# EAGLE design Wake-up Light Controller (EAGLE 8.4.1)
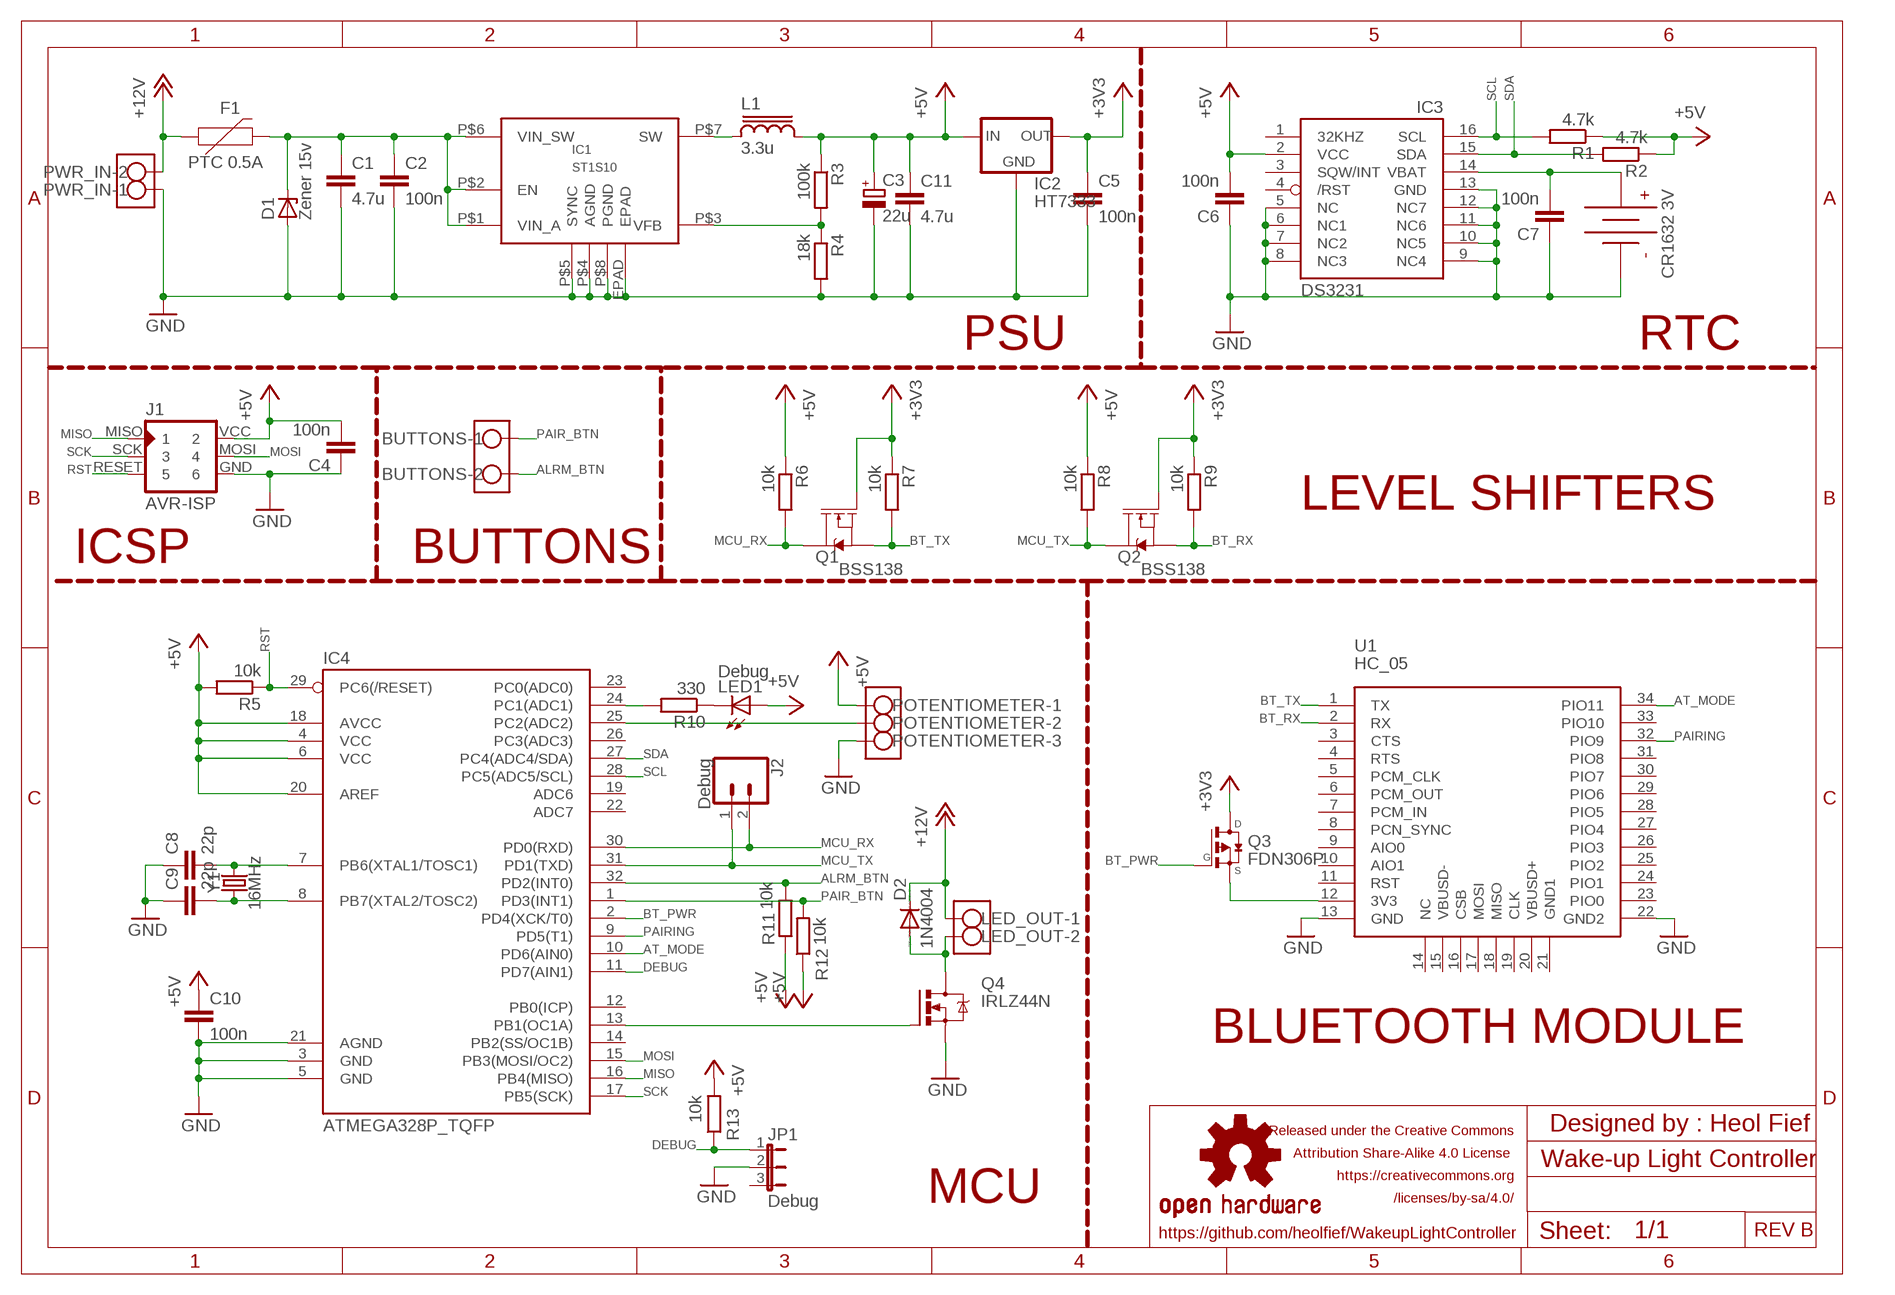
[diagram p0: schematic, sheet 1]

## Parts
BUTTONS  W237-102  [W237-102]
C1  4.7u  C-EUC0805  [C0805]
C2  100n  C-EUC0805  [C0805]
C3  22u  CPOL-EU153CLV-0405  [153CLV-0405]
C4  100n  C-EUC0805  [C0805]
C5  100n  C-EUC0805  [C0805]
C6  100n  C-EUC0805  [C0805]
C7  100n  C-EUC0805  [C0805]
C8  22p  C-EUC0805  [C0805]
C9  22p  C-EUC0805  [C0805]
C10  100n  C-EUC0805  [C0805]
C11  4.7u  C-EUC0805  [C0805]
D1  Zener 15v  ZENER-DIODESOD80C  [SOD80C]
D2  1N4004  DIODE-DO-214AC  [DO-214AC]
F1  PTC 0.5A  PPTC_PTH  [PTH]
IC1  ST1S10  [ST1S10]
IC2  HT7333  [SOT-89]
IC3  DS3231/SO  [SO16W]
IC4  ATMEGA328P_TQFP  [TQFP32-08]
J1  AVR-ISP  AVR-ISP-6PINAVR-ISP-6PIN-SMALL-SILK  [AVR-ISP-6PIN-SMAILL-SILK]
J2  Debug  CONN_021X02_NO_SILK  [1X02_NO_SILK]
J3  CR1632_3V  BATTCON_16MM_PTH  [BATTCON_16MM_PTH]
JP1  Debug  JP2E  [JP2]
L1  3.3u  74437346068  [74437346068]
LED1  Debug  LEDCHIPLED_1206  [CHIPLED_1206]
LED_OUT  W237-102  [W237-102]
LOGO1  OSHW-LOGOM-COPPER  [OSHW-LOGO-M_COPPER]
POTENTIOMETER  W237-103  [W237-103]
PWR_IN  W237-102  [W237-102]
Q1  BSS138  MOSFET-NCH-BSS138  [SOT23-3]
Q2  BSS138  MOSFET-NCH-BSS138  [SOT23-3]
Q3  FDN306P  [SSOT-3]
Q4  IRLZ44N  IRLZ44Z  [TO220BH]
R1  4.7k  RESISTOR_EU  [M0805]
R2  4.7k  R-EU_M0805  [M0805]
R3  100k  R-EU_M0805  [M0805]
R4  18k  R-EU_M0805  [M0805]
R5  10k  R-EU_M0805  [M0805]
R6  10k  RESISTOR_EU  [M0805]
R7  10k  R-EU_M0805  [M0805]
R8  10k  R-EU_M0805  [M0805]
R9  10k  R-EU_M0805  [M0805]
R10  330  R-EU_M0805  [M0805]
R11  10k  R-EU_M0805  [M0805]
R12  10k  R-EU_M0805  [M0805]
R13  10k  R-EU_M0805  [M0805]
U1  HC_05  [BLUETOOTH_SMD]
Y1  16MHz  CRYSTALSMD-3.2X2.5  [CRYSTAL-SMD-3.2X2.5MM]

## Nets
+3V3: C5.1 IC2.1(OUT) Q1.1(G) Q2.1(G) Q3.3(D) R7.1 R9.1
+5V: C3.+ C4.2 C6.2 C10.1 C11.1 IC2.3(IN) IC2.4(IN) IC3.2(VCC) IC4.4(VCC) IC4.6(VCC) IC4.18(AVCC) IC4.20(AREF) J1.VCC L1.2 LED1.A POTENTIOMETER.1 R1.1 R2.1 R3.1 R5.2 R6.1 R8.1 R11.1 R12.1 R13.2
+12V: D2.C F1.P$1 LED_OUT.1 PWR_IN.2
ALRM_BTN: BUTTONS.2 IC4.32(PD2(INT0)) R11.2
AT_MODE: IC4.10(PD6(AIN0)) U1.34(PIO11)
BT_PWR: IC4.2(PD4(XCK/T0)) Q3.1(G)
BT_RX: Q2.2(S) R9.2 U1.2(RX)
BT_TX: Q1.2(S) R7.2 U1.1(TX)
DEBUG: IC4.11(PD7(AIN1)) JP1.1 R13.1
GND: C1.2 C2.2 C3.- C4.1 C5.2 C6.1 C7.1 C8.1 C9.1 C10.2 C11.2 D1.A IC1.EPAD IC1.P$4(AGND) IC1.P$5(SYNC) IC1.P$8(PGND) IC2.2(GND) IC3.5(NC) IC3.6(NC1) IC3.7(NC2) IC3.8(NC3) IC3.9(NC4) IC3.10(NC5) IC3.11(NC6) IC3.12(NC7) IC3.13(GND) IC4.3(GND) IC4.5(GND) IC4.21(AGND) J1.GND J3.GND JP1.2 POTENTIOMETER.3 PWR_IN.1 Q4.S R4.2 U1.13(GND) U1.22(GND2)
MCU_RX: IC4.30(PD0(RXD)) J2.2 Q1.3(D) R6.2
MCU_TX: IC4.31(PD1(TXD)) J2.1 Q2.3(D) R8.2
MISO: IC4.16(PB4(MISO)) J1.MISO
MOSI: IC4.15(PB3(MOSI/OC2)) J1.MOSI
N$1: D2.A LED_OUT.2 Q4.D
N$2: C8.2 IC4.7(PB6(XTAL1/TOSC1)) Y1.3
N$3: IC4.24(PC1(ADC1)) R10.2
N$4: C9.2 IC4.8(PB7(XTAL2/TOSC2)) Y1.1
N$5: Q3.2(S) U1.12(3V3)
N$6: IC1.P$7(SW) L1.1
N$7: IC1.P$3(VFB) R3.2 R4.1
N$8: LED1.C R10.1
N$9: C1.1 C2.1 D1.C F1.P$2 IC1.P$1(VIN_A) IC1.P$2(EN) IC1.P$6(VIN_SW)
N$10: IC4.13(PB1(OC1A)) Q4.G
N$11: IC4.25(PC2(ADC2)) POTENTIOMETER.2
PAIR_BTN: BUTTONS.1 IC4.1(PD3(INT1)) R12.2
PAIRING: IC4.9(PD5(T1)) U1.32(PIO9)
RST: IC4.29(PC6(/RESET)) J1.RESET R5.1
SCK: IC4.17(PB5(SCK)) J1.SCK
SCL: IC3.16(SCL) IC4.28(PC5(ADC5/SCL)) R1.2
SDA: IC3.15(SDA) IC4.27(PC4(ADC4/SDA)) R2.2
VBAT: C7.2 IC3.14(VBAT) J3.VCC@1(VCC) J3.VCC@2(VCC)
Unconnected: IC3.1(32KHZ) IC3.3(SQW/INT) IC3.4(/RST) IC4.12(PB0(ICP)) IC4.14(PB2(SS/OC1B)) IC4.19(ADC6) IC4.22(ADC7) IC4.23(PC0(ADC0)) IC4.26(PC3(ADC3)) JP1.3 U1.3(CTS) U1.4(RTS) U1.5(PCM_CLK) U1.6(PCM_OUT) U1.7(PCM_IN) U1.8(PCN_SYNC) U1.9(AIO0) U1.10(AIO1) U1.11(RST) U1.14(NC) U1.15(VBUSD-) U1.16(CSB) U1.17(MOSI) U1.18(MISO) U1.19(CLK) U1.20(VBUSD+) U1.21(GND1) U1.23(PIO0) U1.24(PIO1) U1.25(PIO2) U1.26(PIO3) U1.27(PIO4) U1.28(PIO5) U1.29(PIO6) U1.30(PIO7) U1.31(PIO8) U1.33(PIO10)

## Notes on the sheet
- CR1632 3V
- PSU | RTC
- LEVEL SHIFTERS
- ICSP | BUTTONS
- BLUETOOTH MODULE
- Designed by : | Heol Fief
- MCU
- Released under the Creative Commons
  Attribution Share-Alike 4.0 License 
  https://creativecommons.org
  /licenses/by-sa/4.0/
- https://github.com/heolfief/WakeupLightController | REV B

## Library data of the parts
BUTTONS LED_OUT PWR_IN = con-wago-500:W237-102: WAGO SCREW CLAMP; MPN: 237-102; OC_FARNELL: unknown; OC_NEWARK: 70K9898
C1 C2 C4-C11 = rcl:C-EU: CAPACITOR, European symbol
C3 = rcl:CPOL-EU: POLARIZED CAPACITOR, European symbol
D1 = diode:ZENER-DIODE: Z-Diode
D2 = diode:DIODE-: DIODE
F1 = SparkFun-Fuses:PPTC: Resettable Fuse PPTC Resettable Fuse. Really a sort of resistor with a polymeric positive temperature coefficient whose resistance increases dramatically with an increase in temperature. When heated by the power passing through the resistance rises causing the current to be limited, protecting the circuit. This is achieved by the transition of the polymer from a crystalline to an amorphous state where the conductive carbon separates breaking the conductive pathways found in the cool crystalline structure. When a PPTC cools back down it resumes conducting letting the circuit turn back on. SparkFun Products: SparkFun RedBoard - Programmed with Arduino <https://www.sparkfun.com/products/12757> Pro Micro - 5V/16MHz <https://www.sparkfun.com/products/12640> Arduino Pro 328 - 5V/16MHz <https://www.sparkfun.com/products/10915> MP3 Trigger <https://www.sparkfun.com/products/13720>; PROD_ID: RES-08490; VALUE: 72V/0.25A
IC1 = BaseApp:ST1S10: Digikey No :- __497-6904-1-ND__
IC2 = holtek2:HT73*
IC3 = adafruit:DS3231
IC4 = SparkFun-IC-Microcontroller:ATMEGA328P_TQFP: Popular 328P in QFP Storefront component: ATmega328 - TQFP <https://www.sparkfun.com/products/13448> (COM-13448) Datasheet <http://www.sparkfun.com/datasheets/Components/SMD/ATMega328.pdf> SparkFun Products SparkFun RedBoard - Programmed with Arduino <https://www.sparkfun.com/products/12757> (DEV-12757) Arduino Pro Mini 328 - 5V/16MHz <https://www.sparkfun.com/products/11113> (DEV-11113) Arduino Pro Mini 328 - 3.3V/8MHz <https://www.sparkfun.com/products/11114> (DEV-11114) SparkFun OpenLog <https://www.sparkfun.com/products/13712> (DEV-13712) SparkFun MicroView - OLED Arduino Module <https://www.sparkfun.com/products/12923> (DEV-12923) SparkFun Digital Sandbox <https://www.sparkfun.com/products/12651> (DEV-12651) SparkFun PicoBoard <https://www.sparkfun.com/products/11888> (WIG-11888) Arduino Fio <https://www.sparkfun.com/products/10116> (DEV-10116) LilyPad Arduino 328 Main Board <https://www.sparkfun.com/products/13342> (DEV-13342) SparkFun RedStick <https://www.sparkfun.com/products/13741> (DEV-13741) LilyPad MP3 <https://www.sparkfun.com/products/11013> (DEV-11013) LilyPad Arduino SimpleSnap <https://www.sparkfun.com/products/10941> (DEV-10941) SparkFun Stepoko <https://www.sparkfun.com/products/13899> (ROB-13899) SparkFun Geiger Counter <https://www.sparkfun.com/products/11345> (SEN-11345) SparkFun EL Sequencer <https://www.sparkfun.com/products/12781> (COM-12781) Arduino Pro 328 - 5V/16MHz <https://www.sparkfun.com/products/10915> (DEV-10915) CryptoCape <https://www.sparkfun.com/products/12773> (DEV-12773) SparkFun IR Thermometer Evaluation Board - MLX90614 <https://www.sparkfun.com/products/10740> (SEN-10740) SparkFun RedBot Mainboard <https://www.sparkfun.com/products/12097> (ROB-12097) Arduino Pro 328 - 3.3V/8MHz <https://www.sparkfun.com/products/10914> (DEV-10914) SparkFun Block for Intel® Edison - Arduino <https://www.sparkfun.com/products/13036> (DEV-13036) SparkFun Simon Says - Surface Mount Soldering Kit <https://www.sparkfun.com/products/10935> (KIT-10935) SparkFun 7-Segment Serial Display - Red <https://www.sparkfun.com/products/11441> (COM-11441) SparkFun 7-Segment Serial Display - White <https://www.sparkfun.com/products/11629> (COM-11629) SparkFun 7-Segment Serial Display - Yellow <https://www.sparkfun.com/products/11443> (COM-11443) SparkFun 7-Segment Serial Display - Kelly Green <https://www.sparkfun.com/products/11440> (COM-11440) SparkFun 7-Segment Serial Display - Blue <https://www.sparkfun.com/products/11442> (COM-11442) SparkFun OpenSegment Serial Display - 20mm (Blue) <https://www.sparkfun.com/products/11647> (COM-11647) SparkFun OpenSegment Serial Display - 20mm (Green) <https://www.sparkfun.com/products/11646> (COM-11646) SparkFun OpenSegment Serial Display - 20mm (White) <https://www.sparkfun.com/products/11648> (COM-11648) SparkFun OpenSegment Serial Display - 20mm (Red) <https://www.sparkfun.com/products/11644> (COM-11644) SparkFun OpenSegment Serial Display - 20mm (Yellow) <https://www.sparkfun.com/products/11645> (COM-11645) SparkFun OpenSegment Shield <https://www.sparkfun.com/products/13190> (DEV-13190); PROD_ID: IC-09069
J1 = avr-isp:AVR-ISP-6PIN: AVR ISP 6pin 3x2 pin header
J2 = SparkFun-Connectors:CONN_02: Multi connection point. Often used as Generic Header-pin footprint for 0.1 inch spaced/style header connections On any of the 0.1 inch spaced packages, you can populate with these: Break Away Headers - Straight <https://www.sparkfun.com/products/116> (PRT-00116) Break Away Male Headers - Right Angle <https://www.sparkfun.com/products/553> (PRT-00553) Female Headers <https://www.sparkfun.com/products/115> (PRT-00115) Break Away Headers - Machine Pin <https://www.sparkfun.com/products/117> (PRT-00117) Break Away Female Headers - Swiss Machine Pin <https://www.sparkfun.com/products/743> (PRT-00743) For SCREWTERMINALS and SPRING TERMINALS visit here: Screw Terimnals on SparkFun.com <https://www.sparkfun.com/search/results?term=Screw+Terminals> (5mm/3.5mm/2.54mm spacing) This device is also useful as a general connection point to wire up your design to another part of your project. Our various solder wires solder well into these plated through hole pads. Hook-Up Wire - Assortment (Stranded, 22 AWG) <https://www.sparkfun.com/products/11375> (PRT-11375) Hook-Up Wire - Assortment (Solid Core, 22 AWG) <https://www.sparkfun.com/products/11367> (PRT-11367) View the entire wire category on our website here <https://www.sparkfun.com/categories/141> Special notes: Molex polarized connector foot print use with: PRT-08233 with associated crimp pins and housings. 2.54_SCREWTERM for use with PRT-10571. 3.5mm Screw Terminal footprints for PRT-08084 5mm Screw Terminal footprints for use with PRT-08432
J3 = heol:BATTCON_16MM_PTH
JP1 = jumper:JP2E: JUMPER
L1 = inductor-wurth:74437346068: POWER INDUCTOR
LED1 = led:LED: LED OSRAM: - CHIPLED LG R971, LG N971, LY N971, LG Q971, LY Q971, LO R971, LY R971 LH N974, LH R974 LS Q976, LO Q976, LY Q976 LO Q996 - Hyper CHIPLED LW Q18S LB Q993, LB Q99A, LB R99A - SideLED LS A670, LO A670, LY A670, LG A670, LP A670 LB A673, LV A673, LT A673, LW A673 LH A674 LY A675 LS A676, LA A676, LO A676, LY A676, LW A676 LS A679, LY A679, LG A679 - Hyper Micro SIDELED® LS Y876, LA Y876, LO Y876, LY Y876 LT Y87S - SmartLED LW L88C, LW L88S LB L89C, LB L89S, LG L890 LS L89K, LO L89K, LY L89K LS L896, LA L896, LO L896, LY L896 - TOPLED LS T670, LO T670, LY T670, LG T670, LP T670 LSG T670, LSP T670, LSY T670, LOP T670, LYG T670 LG T671, LOG T671, LSG T671 LB T673, LV T673, LT T673, LW T673 LH T674 LS T676, LA T676, LO T676, LY T676, LB T676, LH T676, LSB T676, LW T676 LB T67C, LV T67C, LT T67C, LS T67K, LO T67K, LY T67K, LW E67C LS E67B, LA E67B, LO E67B, LY E67B, LB E67C, LV E67C, LT E67C LW T67C LS T679, LY T679, LG T679 LS T770, LO T770, LY T770, LG T770, LP T770 LB T773, LV T773, LT T773, LW T773 LH T774 LS E675, LA E675, LY E675, LS T675 LS T776, LA T776, LO T776, LY T776, LB T776 LHGB T686 LT T68C, LB T68C - Hyper Mini TOPLED® LB M676 - Mini TOPLED Santana® LG M470 LS M47K, LO M47K, LY M47K Source: http://www.osram.convergy.de LUXEON: - LUMILED® LXK2-PW12-R00, LXK2-PW12-S00, LXK2-PW14-U00, LXK2-PW14-V00 LXK2-PM12-R00, LXK2-PM12-S00, LXK2-PM14-U00 LXK2-PE12-Q00, LXK2-PE12-R00, LXK2-PE12-S00, LXK2-PE14-T00, LXK2-PE14-U00 LXK2-PB12-K00, LXK2-PB12-L00, LXK2-PB12-M00, LXK2-PB14-N00, LXK2-PB14-P00, LXK2-PB14-Q00 LXK2-PR12-L00, LXK2-PR12-M00, LXK2-PR14-Q00, LXK2-PR14-R00 LXK2-PD12-Q00, LXK2-PD12-R00, LXK2-PD12-S00 LXK2-PH12-R00, LXK2-PH12-S00 LXK2-PL12-P00, LXK2-PL12-Q00, LXK2-PL12-R00 Source: www.luxeon.com KINGBRIGHT: KA-3528ASYC Source: www.kingbright.com
LOGO1 = SparkFun-Aesthetics:OSHW-LOGO: Open-Source Hardware (OSHW) Logo This logo indicates the piece of hardware it is found on incorporates a OSHW license and/or adheres to the definition of open source hardware found here: http://freedomdefined.org/OSHW
POTENTIOMETER = con-wago-500:W237-103: WAGO SCREW CLAMP; MPN: 237-103; OC_FARNELL: unknown; OC_NEWARK: 18M7116
Q1 Q2 = SparkFun-DiscreteSemi:MOSFET-NCH: N-channel MOSFETs Voltage controlled devices that allow control of high current outputs. SparkFun Products: SparkFun OpenScale <https://www.sparkfun.com/products/13261> SparkFun Digital Sandbox <https://www.sparkfun.com/products/12651> SparkFun Monster Moto Shield <https://www.sparkfun.com/products/10182> SparkFun MOSFET Power Controller <https://www.sparkfun.com/products/11214>; PROD_ID: TRANS-00830; VALUE: 220mA/50V/3.5Ω
Q3 = transistor-fet:FDN306P: P-Channel MOSFET 1.8V Specified PowerTrench
Q4 = transistor-power:IRLZ44Z: N-Channel HEXFET® Power MOSFET Logic Level AUTOMOTIVE MOSFET Source: http://www.irf.com/product-info/datasheets/data/irlz44zpbf.pdf
R1 R6 = heol:RESISTOR_EU
R2-R5 R7-R13 = resistor:R-EU_: RESISTOR, European symbol
U1 = SerialPortBluetooth:HC_05
Y1 = SparkFun-Clocks:CRYSTAL: Crystals (Generic) These are passive quartz crystals, which can be used as a clock source for a microcontroller. Crystal's are two-terminal devices. They require external "load" capacitors to generate an oscillating signal.

## Board
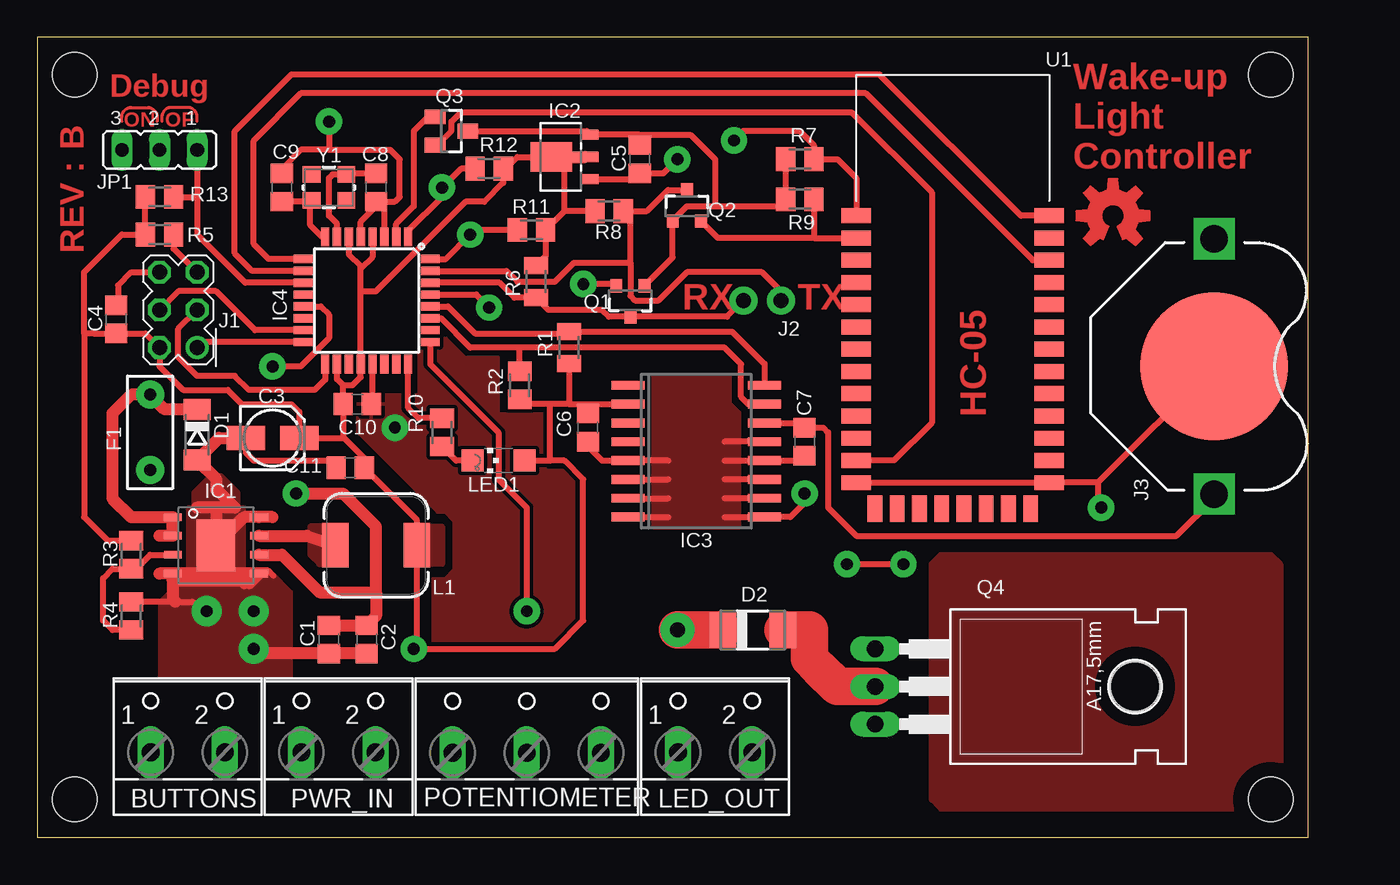
[diagram p1: board, top side]
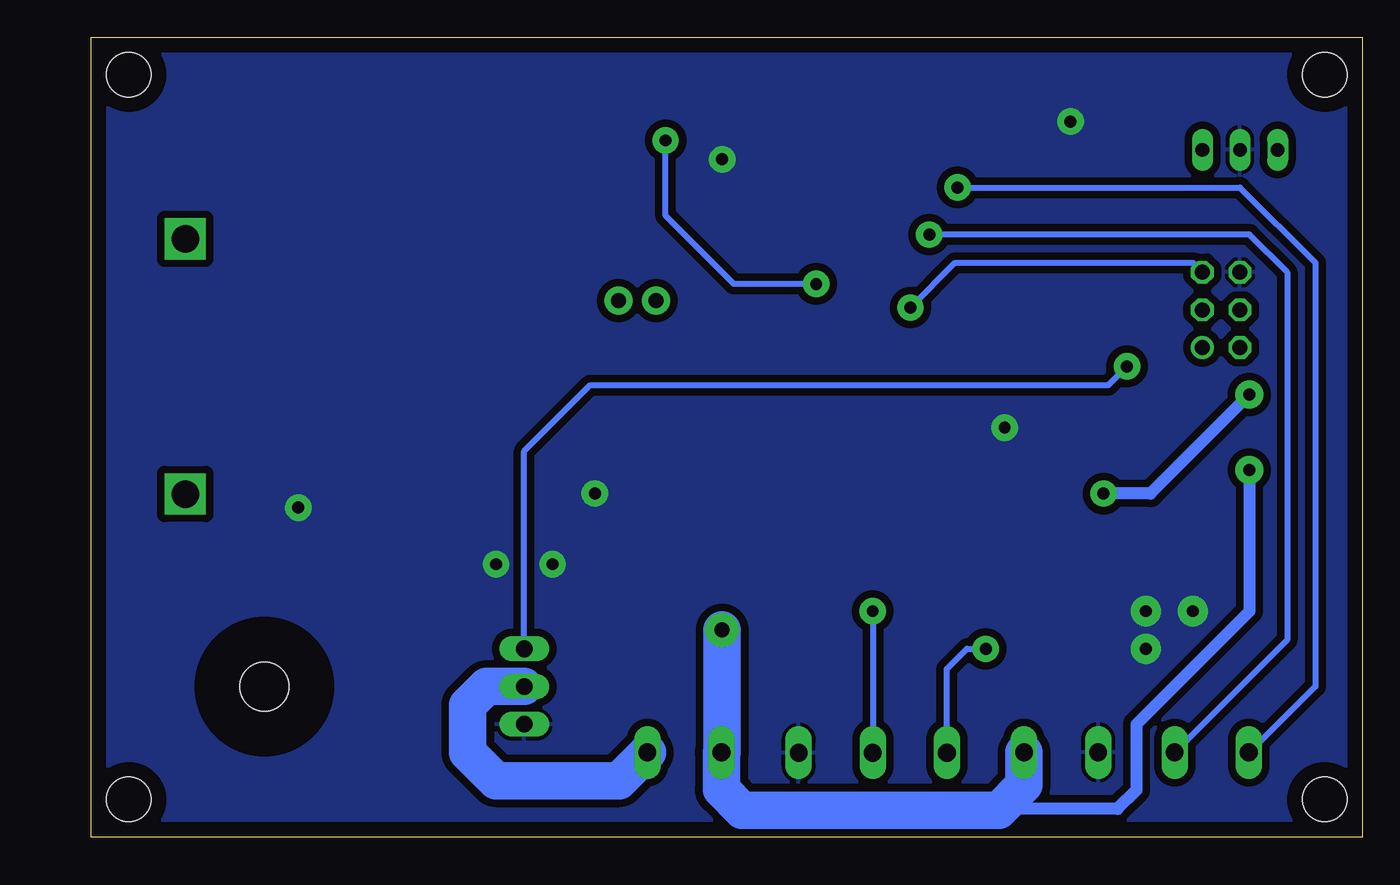
[diagram p2: board, bottom side, seen from below]

Size 85.7 x 53.96 mm. Coordinates in mm from the lower left corner, seen from the top.
Outline: 0,0 85.7,0 85.7,53.96 0,53.96 0,0
Copper layers (1*16): Top 0.035mm / dielectric 1.5mm / Bottom 0.035mm
Design rules "default *": minimum track width 6mil, minimum drill 0.35mm, track to track 6mil, track to pad 6mil, pad to pad 6mil, via to via 6mil, smd to smd 6mil, copper to edge 40mil, drill to drill 6mil, minimum pad ring 10mil, minimum via ring 8mil, stop-mask expansion 4mil, vias tented up to drill 0mil, thermal gap 10mil
Holes 3 mm at 2.54,51.44 83.19,51.44 83.19,2.54 2.54,2.54

### Footprints (pad centres in the part's own frame; a part is rotated, then mirrored left to right if it is on the bottom)
W237-102 = drill 1.194 long: 1 -2.5,-1.27; 2 2.5,-1.27
C0805 = smd 1.3 x 1.5: 1 -0.95,0; 2 0.95,0
153CLV-0405 = smd 2.6 x 1.6: + 1.8,0; - -1.8,0
SOD80C = smd 1.4 x 1.8: A 1.7,0; C -1.7,0
DO-214AC = smd 1.8 x 2.4: A 2.025,0; C -2.025,0
PTH = drill 0.8 pad 1.88: P$1 -2.54,0; P$2 2.54,0
ST1S10 = smd 3.5 x 2.6: EPAD 0,0 | smd 0.5 x 1.2: P$1 -1.905,-2.904; P$2 -0.635,-2.904; P$3 0.635,-2.904; P$4 1.905,-2.904; P$5 1.905,2.904; P$6 0.635,2.904; P$7 -0.635,2.904; P$8 -1.905,2.904
SOT-89 = smd 0.7 x 1.1: 1 1.5,-2.385; 2 -1.5,-2.385 | smd 0.7 x 1.8: 3 0,-2.035 | smd 2 x 2.8: 4 0,0.265
SO16W = smd 0.6 x 2.2: 1 -4.445,-4.6; 2 -3.175,-4.6; 3 -1.905,-4.6; 4 -0.635,-4.6; 5 0.635,-4.6; 6 1.905,-4.6; 7 3.175,-4.6; 8 4.445,-4.6; 9 4.445,4.6; 10 3.175,4.6; 11 1.905,4.6; 12 0.635,4.6; 13 -0.635,4.6; 14 -1.905,4.6; 15 -3.175,4.6; 16 -4.445,4.6
TQFP32-08 = smd 1.27 x 0.559: 1 -4.293,2.8; 2 -4.293,2; 3 -4.293,1.2; 4 -4.293,0.4; 5 -4.293,-0.4; 6 -4.293,-1.2; 7 -4.293,-2; 8 -4.293,-2.8; 17 4.293,-2.8; 18 4.293,-2; 19 4.293,-1.2; 20 4.293,-0.4; 21 4.293,0.4; 22 4.293,1.2; 23 4.293,2; 24 4.293,2.8 | smd 0.559 x 1.27: 9 -2.8,-4.293; 10 -2,-4.293; 11 -1.2,-4.293; 12 -0.4,-4.293; 13 0.4,-4.293; 14 1.2,-4.293; 15 2,-4.293; 16 2.8,-4.293; 25 2.8,4.293; 26 2,4.293; 27 1.2,4.293; 28 0.4,4.293; 29 -0.4,4.293; 30 -1.2,4.293; 31 -2,4.293; 32 -2.8,4.293
AVR-ISP-6PIN-SMAILL-SILK = drill 1.016 octagon: GND 1.27,-2.54; MOSI 1.27,0; RESET -1.27,-2.54; SCK -1.27,0; VCC 1.27,2.54 | drill 1.016: MISO -1.27,2.54
1X02_NO_SILK = drill 1.016 pad 1.88: 1 0,0; 2 2.54,0
BATTCON_16MM_PTH = smd 10 x 10: GND 0,0 | drill 1.854 square: VCC@1 8.604,0; VCC@2 -8.604,0
JP2 = drill 0.914 long: 1 -2.54,0; 2 0,0; 3 2.54,0
74437346068 = smd 1.8 x 3: 1 -2.75,0; 2 2.75,0
CHIPLED_1206 = smd 1.5 x 1.5: A 0,-1.75; C 0,1.75
W237-103 = drill 1.194 long: 1 -5,-1.29; 2 0,-1.29; 3 5,-1.29
SOT23-3 = smd 0.8 x 0.9: 1 -0.95,-1; 2 0.95,-1; 3 0,1.1
SSOT-3 = smd 1 x 1.4: 1 -0.95,-1.1; 2 0.95,-1.1; 3 0,1.1
TO220BH = drill 1.118 long: D 0,-6.35; G -2.54,-6.35; S 2.54,-6.35 | hole 3.302: 0,11.176
M0805 = smd 1.143 x 1.6: 1 -1.077,0; 2 1.077,0
M0805' = smd 1.3 x 1.6: 1 -0.95,0; 2 0.95,0
BLUETOOTH_SMD = smd 2 x 1: 1 0,0; 2 0,-1.5; 3 0,-3; 4 0,-4.5; 5 0,-6; 6 0,-7.5; 7 0,-9; 8 0,-10.5; 9 0,-12; 10 0,-13.5; 11 0,-15; 12 0,-16.5; 13 0,-18; 22 13,-18; 23 13,-16.5; 24 13,-15; 25 13,-13.5; 26 13,-12; 27 13,-10.5; 28 13,-9; 29 13,-7.5; 30 13,-6; 31 13,-4.5; 32 13,-3; 33 13,-1.5; 34 13,0 | smd 1 x 1.8: 14 1.25,-19.75; 15 2.75,-19.75; 16 4.25,-19.75; 17 5.75,-19.75; 18 7.25,-19.75; 19 8.75,-19.75; 20 10.25,-19.75; 21 11.75,-19.75
CRYSTAL-SMD-3.2X2.5MM = smd 1.2 x 1.1: 1 -1.175,-0.875; 2 1.175,-0.875; 3 1.175,0.875; 4 -1.175,0.875

### Placement (x,y rotation side)
BUTTONS  10.16,6.99 0 top
C1  19.68,13.34 270 top
C2  22.23,13.34 270 top
C3  15.88,26.92 0 top
C4  5.33,34.92 270 top
C5  40.64,45.72 270 top
C6  37.15,27.62 90 top
C7  51.75,26.67 90 top
C8  22.86,43.81 90 top
C9  16.51,43.81 270 top
C10  21.59,29.21 0 top
C11  21.11,24.92 180 top
D1  10.79,27.15 270 top
D2  48.26,13.97 0 top
F1  7.62,27.3 90 top
IC1  12.06,19.68 270 top
IC2  34.92,45.88 90 top
IC3  44.45,26.04 270 top
IC4  22.23,36.2 270 top
J1  9.53,35.56 180 top
J2  50.16,36.2 180 top
J3  79.38,31.75 270 top
JP1  8.26,46.35 180 top
L1  22.86,19.68 0 top
LED1  31.11,25.4 90 top
LED_OUT  45.72,6.99 0 top
LOGO1  72.55,41.91 0 top
POTENTIOMETER  33.02,6.99 0 top
PWR_IN  20.32,6.99 0 top
Q1  40.01,36.2 180 top
Q2  43.81,42.55 0 top
Q3  27.94,47.62 270 top
Q4  62.87,10.16 270 top
R1  35.88,33.02 90 top
R2  4.7k  [M0805']  32.54,30.48 90 top
R3  100k  [M0805']  6.35,19.05 270 top
R4  18k  [M0805']  6.35,14.92 90 top
R5  10k  [M0805']  8.26,40.64 180 top
R6  33.66,37.47 270 top
R7  10k  [M0805']  51.44,45.72 0 top
R8  10k  [M0805']  38.58,42.23 0 top
R9  10k  [M0805']  51.44,43.02 0 top
R10  330  [M0805']  27.3,27.3 90 top
R11  10k  [M0805']  33.34,40.96 180 top
R12  10k  [M0805']  30.48,45.09 180 top
R13  10k  [M0805']  8.26,43.18 180 top
U1  55.24,41.91 0 top
Y1  19.68,43.81 0 top

### Tracks (layer width: path | path; a pad name or v marks a point on that pad's centre or on a via)
+3V3
  Top 0.406: Q3.3 37.06,47.62 IC2.1 40.64,47.38 | R7.1 R9.1 50.01,42.55 45.72,42.55 | 40.64,47.38 44.06,47.38 45.72,45.72 45.72,42.55 | Q1.1 42.87,39.1 Q2.1 42.87,41.59 43.81,42.55 45.72,42.55 | C5.1 40.64,47.38
+5V  (via drill 0.8 pad 1.78)
  Top 0.406: 20.95,40.42 IC4.6 21.02,39.3 21.82,38.5 21.82,38.34 | 20.64,30.48 20.23,30.89 IC4.18 | 20.64,30.48 21.27,30.48 21.82,31.03 IC4.20 21.82,36.83 | 20.64,30.48 20.64,29.84 C10.1 20.64,26.98 20.7,26.92 | IC4.4 22.62,39.13 21.82,38.34 | 21.82,36.83 22.86,36.83 28.89,42.86 30.16,42.86 31.43,44.13 R12.1 31.59,45.09 32.38,45.88 IC2.4 35.56,44.98 35.56,42.23 | 21.82,36.83 21.82,38.34 | R3.1 4.76,20 3.17,21.59 3.17,33.97 | 34.61,29.21 32.86,29.21 R2.1 | R13.2 R5.2 5.71,40.64 3.17,38.1 3.17,33.97 | 34.61,25.4 34.61,29.21 | 3.17,33.97 3.81,33.98 C4.2 7.3,33.98 J1.VCC 8.26,31.75 9.84,30.16 12.86,30.16 13.81,29.21 17.14,29.21 17.68,28.68 C3.+ 20.7,26.92 | LED1.A 34.61,25.4 | 34.61,25.4 35.56,25.4 36.83,24.13 36.83,14.61 34.92,12.7 v25.4,12.7 25.61,12.91 L1.2 25.61,21.38 C11.1 22.23,25.09 22.23,25.4 20.7,26.92 | 36.83,29.21 IC3.2 | 35.88,29.21 36.83,29.21 | 35.88,29.21 34.61,29.21 | C6.2 37.15,28.89 36.83,29.21 | R1.1 35.88,29.21 | R6.1 34.29,39.17 R11.1 35.56,42.23 | R8.1 35.56,42.23
  Top 0.813: IC2.4 IC2.3
  Bottom 0.406: v25.4,12.7 26.67,12.7 28.02,11.35 POTENTIOMETER.1
  pour Top (no thermals): 26.04,20.95 27.3,20.95 27.3,18.41 26.04,18.41
+12V  (via drill 1 pad 2.29)
  Top 2.54: D2.C v43.18,13.97
  Bottom 0.813: 24.52,1.83 24.45,1.91 16.51,1.91 15.24,3.17 15.24,7.62 7.62,15.24 F1.P$1
  Bottom 2.54: PWR_IN.2 22.82,3.53 24.52,1.83 41.83,1.83 43.22,3.21 LED_OUT.1 43.18,5.75 v43.18,13.97
ALRM_BTN  (via drill 0.8 pad 1.78)
  Top 0.406: IC4.32 27.57,38.99 v29.21,40.64 29.53,40.96 R11.2
  Bottom 0.406: BUTTONS.2 5.08,13.29 5.08,38.1 7.62,40.64 v29.21,40.64
AT_MODE
  Top 0.406: IC4.10 14.51,38.2 13.34,39.37 13.34,47.63 17.14,51.44 56.81,51.44 66.34,41.91 U1.34
BT_PWR
  Top 0.406: IC4.2 24.23,41.37 25.4,42.55 25.4,47.62 26.35,48.58 Q3.1
BT_RX
  Top 0.406: R9.2 52.38,41.91 | 52.38,41.91 52.38,41.59 | Q2.2 45.9,40.41 52.39,40.41 | 52.39,40.41 U1.2 | 52.38,41.91 52.38,40.41 52.39,40.41
BT_TX  (via drill 0.8 pad 1.78)
  Top 0.406: v46.99,46.99 47.62,47.62 51.44,47.62 52.38,46.67 R7.2 53.98,45.72 55.24,44.45 U1.1 | Q1.2 38.94,37.31 v36.83,37.31
  Bottom 0.406: v36.83,37.31 42.39,37.31 46.99,41.91 v46.99,46.99
DEBUG
  Top 0.406: 10.79,43.18 10.79,40.64 14.04,37.4 IC4.11 | R13.1 10.79,43.18 | JP1.1 10.79,43.18
GND  (via drill 0.8 pad 1.78, 0.8 pad 2.03)
  Top 0.406: R4.2 9.31,15.87 10.48,15.87 10.79,15.56 | 23.5,40.42 IC4.3 | 23.5,40.56 IC4.3 | IC4.5 21.82,41.51 22.86,42.55 C8.1 23.33,42.87 | C9.1 16.51,45.09 17.78,46.35 19.68,46.35 | 23.33,42.87 24.13,42.87 24.45,43.18 24.45,45.72 23.81,46.35 19.68,46.35 | IC4.3 23.43,42.77 23.33,42.87 | IC4.21 22.62,29.3 C10.2 | U1.13 U1.22 71.53,23.91 | J1.GND 6.35,38.1 5.46,37.21 5.46,36 C4.1 | 46.99,24.13 IC3.11 46.35,24.13 | 42.55,25.4 IC3.5 38.1,25.4 37.15,26.35 C6.1 | IC3.6 42.55,24.13 | IC3.7 42.55,22.86 | IC3.8 42.55,21.59 | 46.35,21.59 IC3.9 50.8,21.59 51.75,22.54 v51.75,23.18 | IC3.10 46.35,22.86 | 46.35,25.4 IC3.12 51.43,25.4 C7.1 | IC3.13 46.35,26.67 | IC2.2 40.25,44.38 C5.2 42.23,44.77 v43.18,45.72 | 71.53,23.91 71.53,22.45 v71.75,22.23 | J3.GND 71.53,23.91 | v19.68,48.26 19.68,46.35 | 15.93,17.62 15.56,17.98 14.95,17.98 | v54.61,18.41 v58.42,18.41 | C11.2 19.69,25.4 14.61,25.4 14.07,25.93 C3.-
  Top 0.813: 15.88,21.59 IC1.P$8 13.97,21.59 IC1.EPAD 12.06,22.23 | IC1.P$4 8.26,17.78 | 9.16,17.27 IC1.P$4 | 9.16,17.27 9.16,16.03 9.31,15.87 | 12.06,22.23 13.34,22.23 12.13,23.43 12.06,23.43 12.06,24.18 D1.A 12.27,26.92 C3.- | 12.06,22.23 10.79,22.23 | 9.16,17.27 13.85,17.27 13.97,17.14 14.33,17.14 IC1.P$5 IC1.P$4 | C2.2 C1.2 14.92,12.38 v14.61,12.7
  other vias: 11.43,15.24 14.61,15.24 24.13,27.62
  pour Top (rank 2, no thermals): 17.14,16.51 15.88,17.78 13.97,17.78 13.97,22.23 13.59,22.23 13.59,23.24 12.45,24.38 11.68,24.38 10.54,23.24 10.54,22.23 10.16,22.23 10.16,17.78 8.26,15.88 8.26,10.79 17.14,10.79
  pour Bottom (isolate 0.508, rank 2): 0,53.98 0,0 85.72,0 85.72,53.98
  pour Bottom: 62.87,52.07 62.87,44.45 78.11,44.45 78.11,52.07
  pour Top: 41.59,20.95 47.31,20.95 47.31,28.57 46.67,29.21 46.67,31.11 41.59,31.11
  pour Top (isolate 0.254): 25.72,33.66 25.72,29.84 21.59,29.84 21.59,27.3 26.99,21.91 27.46,21.91 28.1,21.27 28.1,18.1 27.46,17.46 26.67,17.46 26.67,12.7 36.2,12.7 36.2,24.77 34.29,24.77 34.29,28.57 31.11,28.57 31.11,32.38 28.89,32.38 27.62,33.66
HEATSINK
  pour Top: 60.33,2.54 60.33,18.41 60.96,19.05 83.19,19.05 83.82,18.41 83.82,3.17 82.55,1.91 60.96,1.91
MCU_RX
  Top 0.406: J2.2 46.52,35.09 Q1.3 38.56,35.09 38.1,35.56 34.48,35.56 R6.2 32.19,36.39 31.18,37.4 IC4.30
MCU_TX
  Top 0.406: Q2.3 42.55,43.65 41.13,42.23 R8.2 40.01,41.75 40.01,38.73 | 40.01,38.73 40.01,36.51 40.32,36.2 41.91,36.2 43.81,38.1 48.9,38.1 50.16,36.83 J2.1 | IC4.31 31.66,38.2 32.38,37.47 34.92,37.47 36.2,38.73 40.01,38.73
MISO
  Top 0.406: IC4.16 11.17,33.4 J1.MISO
MOSI
  Top 0.406: J1.MOSI 9.53,36.83 12.06,36.83 14.7,34.2 IC4.15
N$1
  Top 2.54: Q4.D 53.98,10.16 52.7,11.43 52.07,12.06 52.07,13.97 D2.A
  Bottom 2.54: LED_OUT.2 50.12,3.81 58.42,3.81 60.33,5.71 60.33,8.89 59.05,10.16 Q4.D
N$2
  Top 0.406: C8.2 20.93,44.77 Y1.3 19.93,44.69 19.68,44.45 19.68,41.91 20.23,41.37 IC4.7
N$3
  Top 0.406: IC4.24 25.02,28.95 25.72,28.25 R10.2
N$4
  Top 0.406: 18.43,42.87 C9.2 | 18.43,42.87 Y1.1 | IC4.8 19.2,40.49 18.41,41.27 18.41,42.84 18.43,42.87
N$5
  Top 0.406: U1.12 57.8,25.41 60.33,27.94 60.33,43.5 54.93,48.9 28.57,48.9 27.94,48.26 27.94,47.62 26.99,46.67 Q3.2
N$6
  Top 0.813: IC1.P$7 18.2,20.32 L1.1
  pour Top (no thermals): 18.41,20.95 18.41,19.05 19.05,18.41 19.68,18.41 19.68,20.95
N$7
  Top 0.406: R4.1 5.08,13.97 4.45,14.61 4.45,17.46 5.08,18.1 R3.2 6.67,18.1 7.62,19.05 IC1.P$3
N$8
  Top 0.406: 28.89,25.88 LED1.C 28.26,25.4 R10.1
N$9  (via drill 0.8 pad 1.78)
  Top 0.813: 8.26,20.32 IC1.P$2 IC1.P$1 6.35,21.59 5.08,22.86 5.08,28.57 6.35,29.84 F1.P$2 8.62,28.85 D1.C | v17.46,23.18 20.64,23.18 22.86,20.95 22.86,16.51 | C1.1 C2.1 22.86,14.92 22.86,16.51 | IC1.P$6 16.51,19.05 19.05,16.51 22.86,16.51
  Bottom 0.813: v17.46,23.18 14.29,23.18 F1.P$2
N$10  (via drill 0.8 pad 1.78)
  Top 0.406: IC4.13 19.13,35.8 19.68,35.24 19.68,33.66 17.78,31.75 v15.88,31.75
  Bottom 0.406: Q4.G 56.52,26.04 52.07,30.48 17.14,30.48 v15.88,31.75
N$11  (via drill 0.8 pad 1.78)
  Top 0.406: v33.02,15.24 33.02,22.23 31.11,24.13 31.11,27.3 26.52,31.9 IC4.25
  Bottom 0.406: v33.02,15.24 POTENTIOMETER.2
N$12
  Top 0.203: 10.79,48.26 10.79,48.58 arc90 10.16,49.21 9.05,49.21 arc90 8.41,48.58 8.41,48.26
N$13
  Top 0.203: 5.71,48.26 5.71,48.58 arc-90 6.35,49.21 7.46,49.21 arc-90 8.1,48.58 8.1,48.26
PAIR_BTN  (via drill 0.8 pad 1.78)
  Top 0.406: 25.02,40.58 IC4.1 25.02,40.9 27.3,43.18 v27.3,43.81 28.57,45.09 R12.2
  Bottom 0.406: v27.3,43.81 8.26,43.81 3.17,38.73 3.17,10.16 7.62,5.71 BUTTONS.1
PAIRING
  Top 0.406: U1.32 67.14,38.91 55.88,50.16 17.78,50.16 14.61,46.99 14.61,40.01 15.62,38.99 IC4.9
RST  (via drill 0.8 pad 1.78)
  Top 0.406: IC4.29 29.6,36.59 v30.48,35.72 | R5.1 9.21,39.69 J1.RESET
  Bottom 0.406: J1.RESET 11.43,38.73 27.46,38.73 v30.48,35.72
SCK
  Top 0.406: J1.SCK 9.53,34.29 9.53,32.38 10.79,31.11 13.34,31.11 14.29,30.16 18.73,30.16 19.43,30.86 IC4.17
SCL
  Top 0.406: IC4.28 27.7,35.8 29.53,33.97 35.75,33.97 R1.2 46.87,34.1 49.05,31.91 IC3.16
SDA
  Top 0.406: IC3.15 47.94,29.21 47.47,29.69 47.47,31.91 46.35,33.02 32.54,33.02 | IC4.27 27.23,34.99 29.21,33.02 32.54,33.02 | R2.2 32.54,33.02
VBAT
  Top 0.406: J3.VCC@1 79.38,22.86 76.83,20.32 55.24,20.32 53.34,22.23 53.34,27.3 53.02,27.62 C7.2 51.43,27.94 IC3.14

### Text on the board
Top: Debug | ON | OF | B | Wake-up / Light / Controller | REV : | RX | TX | HC-05
bRestrict: Heol Fief / 2017